# Altium schematic sheet filterbank_amp.SchDoc
size A3
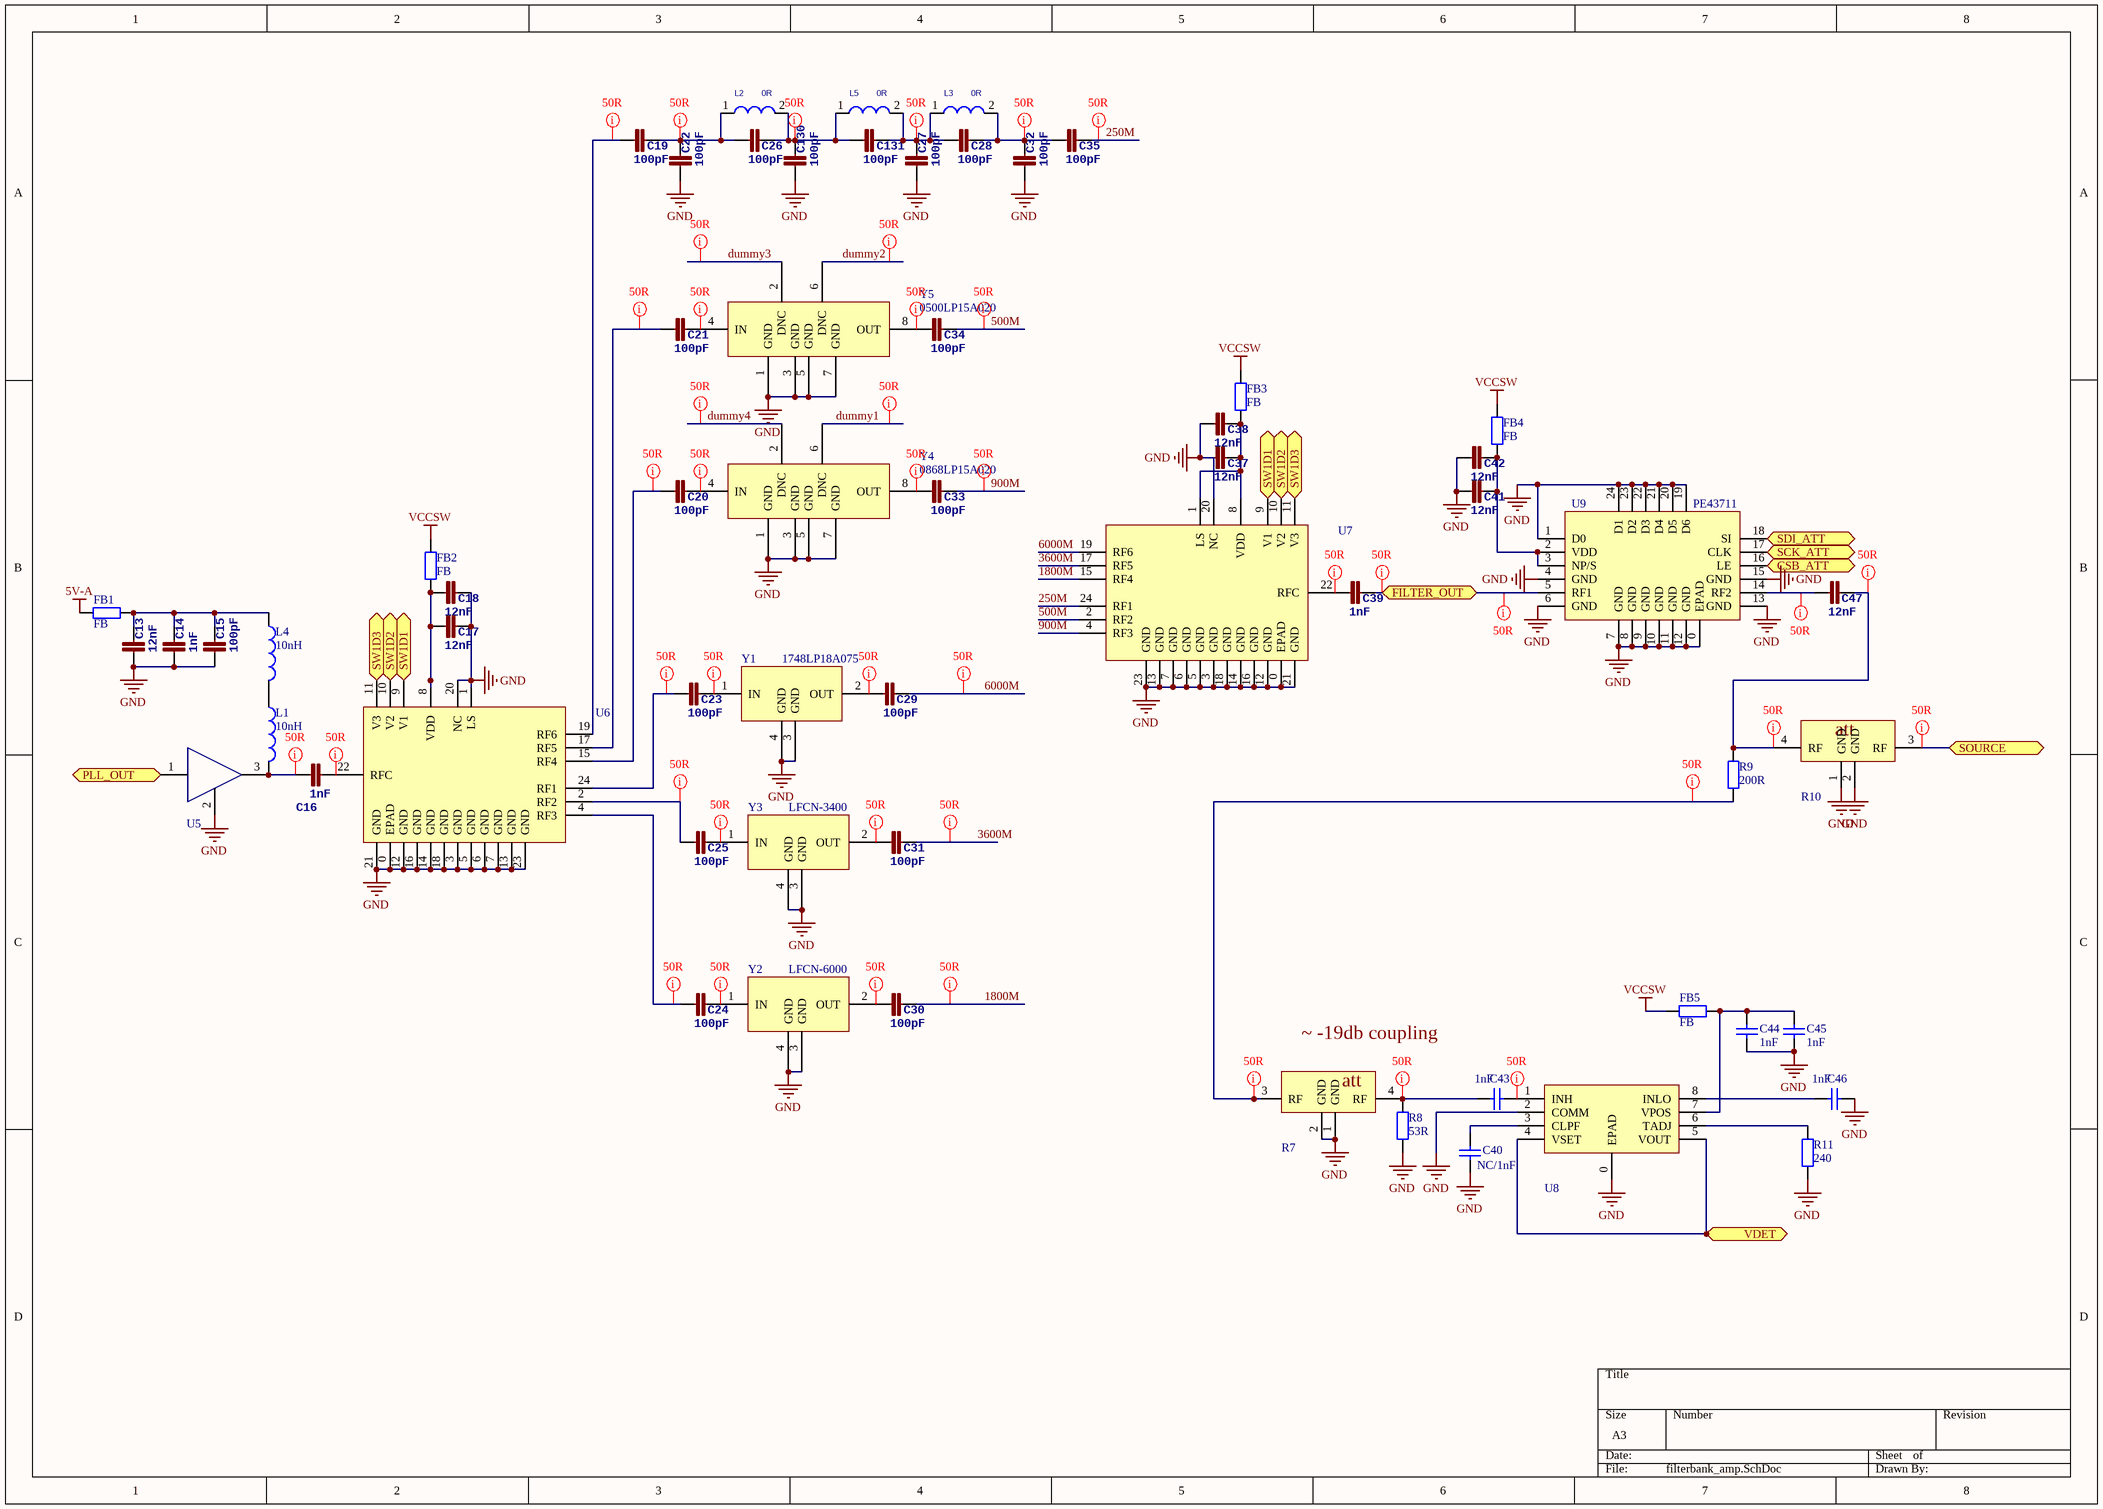
[diagram p0: filterbank_amp.SchDoc]

## Parts
C13  12nF  [0805]
C14  1nF  [0402]
C15  100pF  [0402]
C16  1nF  [0402]
C17  12nF  [0402]
C18  12nF  [0402]
C19  100pF  [0402]
C20  100pF  [0402]
C21  100pF  [0402]
C22  100pF  [0402]
C23  100pF  [0402]
C24  100pF  [0402]
C25  100pF  [0402]
C26  100pF  [0402]
C27  100pF  [0402]
C28  100pF  [0402]
C29  100pF  [0402]
C30  100pF  [0402]
C31  100pF  [0402]
C32  100pF  [0402]
C33  100pF  [0402]
C34  100pF  [0402]
C35  100pF  [0402]
C37  12nF  [0402]
C38  12nF  [0402]
C39  1nF  [0402]
C40  NC/1nF  [0402]
C41  12nF  [0402]
C42  12nF  [0402]
C43  1nF  [0402]
C44  1nF  [0402]
C45  1nF  [0402]
C46  1nF  [0402]
C47  12nF  [0201]
C130  100pF  [0402]
C131  100pF  [0402]
FB1  FB  [0402]
FB2  FB  [0402]
FB3  FB  [0402]
FB4  FB  [0402]
FB5  FB  [0402]
L1  value 10nH  [0402]  (hidden comment: Inductor)
L2  0R  [0402]
L3  0R  [0402]
L4  value 10nH  [0603]  (hidden comment: Inductor)
L5  0R  [0402]
R7  EXB24-RF-ATT  [EXB24AT-RF-ATT]  (value not drawn)
R8  53R  [0402]
R9  200R  [0201]
R10  EXB24-RF-ATT  [EXB24AT-RF-ATT]  (value not drawn)
R11  240  [0402]
U5  AMP-SOT89  [SOT-89]  (value not drawn)
U6  PE42462  [PE42462]  (value not drawn)
U7  PE42462  [PE42462]  (value not drawn)
U8  AD8319  [AD8319]  (value not drawn)
U9  PE43711  [PE43711]
Y1  1748LP18A075  [1748LP18A075]
Y2  LFCN-6000  [1748LP18A075]
Y3  LFCN-3400  [1748LP18A075]
Y4  0868LP15A020  [5515LP15A730/0868LP15A020]
Y5  0500LP15A020  [5515LP15A730/0868LP15A020]

## Ports
CSB_ATT, FILTER_OUT, PLL_OUT, SCK_ATT, SDI_ATT, SOURCE, SW1D1, SW1D2, SW1D3, VDET

## Nets
5V-A: FB1.1
GND: C13.1 C14.1 C15.1 C17.2 C18.2 C22.1 C27.1 C32.1 C37.1 C38.1 C40.1 C41.1 C42.1 C44.1 C45.1 C46.2 C130.1 R7.1(GND) R7.2(GND) R8.2 R10.1(GND) R10.2(GND) R11.2 U5.2 U6.0(EPAD) U6.1(LS) U6.3(GND) U6.5(GND) U6.6(GND) U6.7(GND) U6.12(GND) U6.13(GND) U6.14(GND) U6.16(GND) U6.18(GND) U6.20(NC) U6.21(GND) U6.23(GND) U7.0(EPAD) U7.3(GND) U7.5(GND) U7.6(GND) U7.7(GND) U7.12(GND) U7.13(GND) U7.14(GND) U7.16(GND) U7.18(GND) U7.20(NC) U7.21(GND) U7.23(GND) U8.0(EPAD) U8.2(COMM) U9.0(EPAD) U9.1(D0) U9.4(GND) U9.6(GND) U9.7(GND) U9.8(GND) U9.9(GND) U9.10(GND) U9.11(GND) U9.12(GND) U9.13(GND) U9.15(GND) U9.19(D6) U9.20(D5) U9.21(D4) U9.22(D3) U9.23(D2) U9.24(D1) Y1.3(GND) Y1.4(GND) Y2.3(GND) Y2.4(GND) Y3.3(GND) Y3.4(GND) Y4.1(GND) Y4.3(GND) Y4.5(GND) Y4.7(GND) Y5.1(GND) Y5.3(GND) Y5.5(GND) Y5.7(GND)
VCCSW: FB2.2 FB3.2 FB4.2 FB5.1
250M: C35.2 U7.24(RF1)
500M: C34.2 U7.2(RF2)
900M: C33.2 U7.4(RF3)
1800M: C30.2 U7.15(RF4)
3600M: C31.2 U7.17(RF5)
6000M: C29.2 U7.19(RF6)
CSB_ATT: U9.16(LE) ; port CSB_ATT
dummy1: Y4.6(DNC)
dummy2: Y5.6(DNC)
dummy3: Y5.2(DNC)
dummy4: Y4.2(DNC)
FILTER_OUT: C39.2 U9.5(RF1) ; port FILTER_OUT
PLL_OUT: U5.1 ; port PLL_OUT
SCK_ATT: U9.17(CLK) ; port SCK_ATT
SDI_ATT: U9.18(SI) ; port SDI_ATT
SOURCE: R10.3(RF) ; port SOURCE
SW1D1: U6.9(V1) U7.9(V1) ; port SW1D1
SW1D2: U6.10(V2) U7.10(V2) ; port SW1D2
SW1D3: U6.11(V3) U7.11(V3) ; port SW1D3
VDET: U8.4(VSET) U8.5(VOUT) ; port VDET
NetC13_2: C13.2 C14.2 C15.2 FB1.2 L4.1
NetC16_1: C16.1 L1.2 U5.3
NetC16_2: C16.2 U6.22(RFC)
NetC17_1: C17.1 C18.1 FB2.1 U6.8(VDD)
NetC19_1: C19.1 U6.19(RF6)
NetC19_2: C19.2 C22.2 C26.1 L2.1
NetC20_1: C20.1 U6.15(RF4)
NetC20_2: C20.2 Y4.4(IN)
NetC21_1: C21.1 U6.17(RF5)
NetC21_2: C21.2 Y5.4(IN)
NetC23_1: C23.1 U6.24(RF1)
NetC23_2: C23.2 Y1.1(IN)
NetC24_1: C24.1 U6.4(RF3)
NetC24_2: C24.2 Y2.1(IN)
NetC25_1: C25.1 U6.2(RF2)
NetC25_2: C25.2 Y3.1(IN)
NetC26_2: C26.2 C130.2 C131.1 L2.2 L5.1
NetC27_2: C27.2 C28.1 C131.2 L3.1 L5.2
NetC28_2: C28.2 C32.2 C35.1 L3.2
NetC29_1: C29.1 Y1.2(OUT)
NetC30_1: C30.1 Y2.2(OUT)
NetC31_1: C31.1 Y3.2(OUT)
NetC33_1: C33.1 Y4.8(OUT)
NetC34_1: C34.1 Y5.8(OUT)
NetC37_2: C37.2 C38.2 FB3.1 U7.1(LS) U7.8(VDD)
NetC39_1: C39.1 U7.22(RFC)
NetC40_2: C40.2 U8.3(CLPF)
NetC41_2: C41.2 C42.2 FB4.1 U9.2(VDD) U9.3(NP/S)
NetC43_1: C43.1 R7.4(RF) R8.1
NetC43_2: C43.2 U8.1(INH)
NetC44_2: C44.2 C45.2 FB5.2 U8.7(VPOS)
NetC46_1: C46.1 U8.8(INLO)
NetC47_1: C47.1 U9.14(RF2)
NetC47_2: C47.2 R9.1 R10.4(RF)
NetL1_1: L1.1 L4.2
NetR7_3: R7.3(RF) R9.2
NetR11_1: R11.1 U8.6(TADJ)

## Layout directives
net class 50R: 250M, 500M, 900M, 1800M, 3600M, 6000M, dummy1, dummy2, dummy3, dummy4, FILTER_OUT, NetC16_1, NetC16_2, NetC19_1, NetC19_2, NetC20_1, NetC20_2, NetC21_1, NetC21_2, NetC23_1, NetC23_2, NetC24_1, NetC24_2, NetC25_1, NetC25_2, NetC26_2, NetC27_2, NetC28_2, NetC29_1, NetC30_1, NetC31_1, NetC33_1, NetC34_1, NetC39_1, NetC43_1, NetC43_2, NetC47_1, NetC47_2, NetR7_3, SOURCE

## Notes on the sheet
- ~ -19db coupling
- (in symbol EXB24-RF-ATT) att

## Library data of the parts
C13-C35 C37-C39 C41 C42 C47 C130 C131 = CAP0402-CAP: <b>Capacitor</b> / Standard 0603 ceramic capacitor, and 0.1" leaded capacitor.; PARTNO: CC0402ZRY5V7BB104
C40 C43-C46 = Cap: Capacitor; Published: 8-Jun-2000; LatestRevisionDate: 17-Jul-2002; LatestRevisionNote: Re-released for DXP Platform.; PackageReference: RAD-0.3; Publisher: Altium Limited; PackageDescription: Radial Cap, Thru-Hole; 2 Leads; 0.3 in Pin Spacing
FB1-FB5 R8 R9 R11 = Res2: Resistor; Published: 8-Jun-2000; LatestRevisionDate: 17-Jul-2002; LatestRevisionNote: Re-released for DXP Platform.; PackageReference: AXIAL-0.4; Publisher: Altium Limited; PackageDescription: Axial Device, Thru-Hole; 2 Leads; 0.4 in Pin Spacing
L1 L4 = Inductor: Code_IEC: 1005; Published: 8-Jun-2000; LatestRevisionDate: 29-May-2009; LatestRevisionNote: IPC-7351 Footprint Added.; PackageReference: 0402-A; Publisher: Altium Limited; PackageDescription: Chip Inductor; Code_JEITA: 0402
L2 L3 L5 = L/2.5*2.0
Y2 Y3 = 1748LP18A075
Y4 Y5 = 5515LP15A730/0868LP15A020